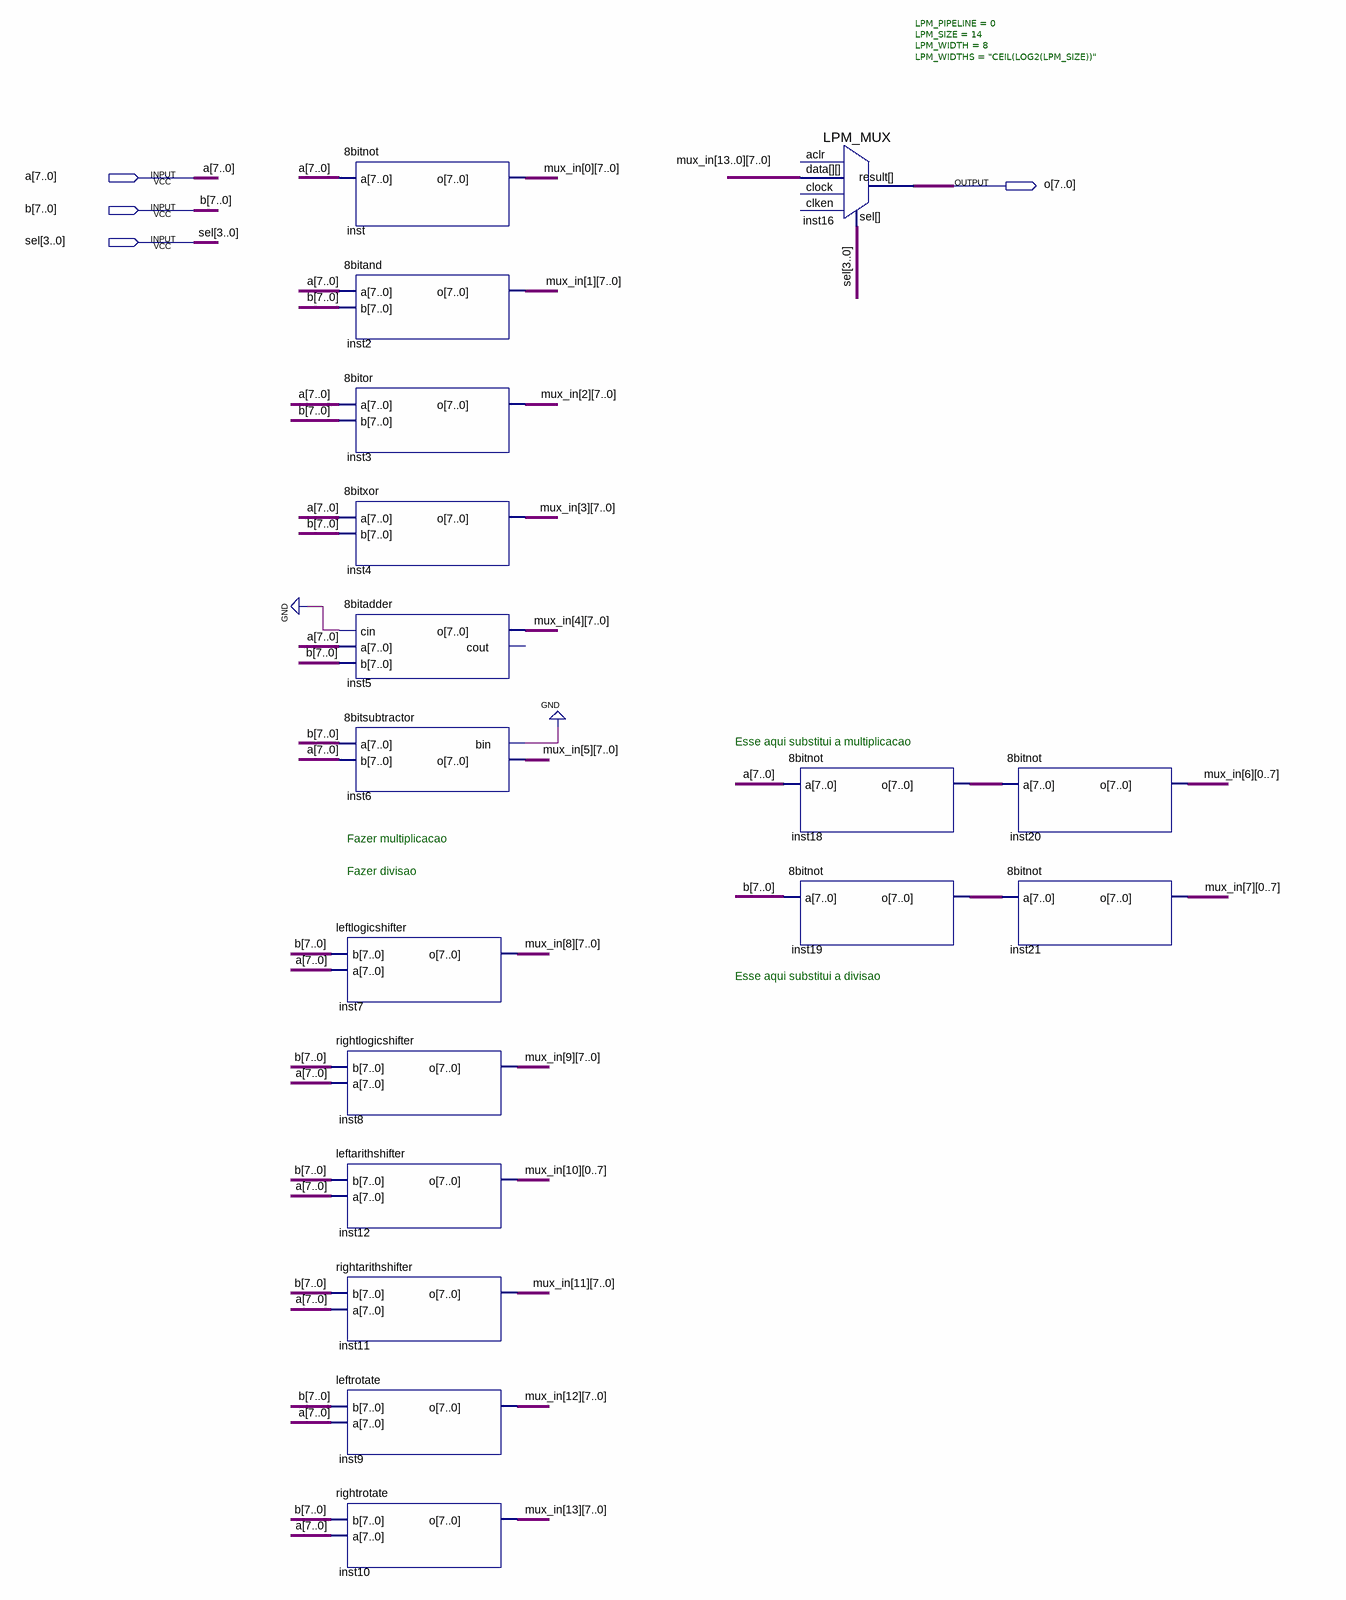
[diagram p0: schematic sheet]
// Quartus schematic ula.bdf as structural Verilog: 17 symbols, 4 pins
module ula (
  input  [7:0] a,
  input  [7:0] b,
  input  [3:0] sel,
  output [7:0] o
);

  wire inst6_bin;
  wire [7:0] inst18_o, inst19_o, mux_in_0, mux_in_1, mux_in_2, mux_in_3, mux_in_4, mux_in_5, mux_in_6,
       mux_in_7, mux_in_8, mux_in_9, mux_in_10, mux_in_11, mux_in_12, mux_in_13;

  \8bitnot  inst (.a(a), .o(mux_in_0));
  \8bitand  inst2 (.a(a), .b(b), .o(mux_in_1));
  \8bitor  inst3 (.a(a), .b(b), .o(mux_in_2));
  \8bitxor  inst4 (.a(a), .b(b), .o(mux_in_3));
  \8bitadder  inst5 (.cin(1'b0), .a(a), .b(b), .o(mux_in_4));  // open: cout
  \8bitsubtractor  inst6 (.a(b), .b(a), .bin(inst6_bin), .o(mux_in_5));
  leftlogicshifter inst7 (.b(b), .a(a), .o(mux_in_8));
  rightlogicshifter inst8 (.b(b), .a(a), .o(mux_in_9));
  leftarithshifter inst12 (
    .b(b), .a(a),
    .o({mux_in_10[0], mux_in_10[1], mux_in_10[2], mux_in_10[3], mux_in_10[4], mux_in_10[5], mux_in_10[6], mux_in_10[7]}));
  rightarithshifter inst11 (.b(b), .a(a), .o(mux_in_11));
  leftrotate inst9 (.b(b), .a(a), .o(mux_in_12));
  rightrotate inst10 (.b(b), .a(a), .o(mux_in_13));
  LPM_MUX #(.LPM_PIPELINE(0), .LPM_SIZE(14), .LPM_WIDTH(8), .LPM_WIDTHS("CEIL(LOG2(LPM_SIZE))")) inst16 (
    .data({mux_in_13, mux_in_12, mux_in_11, mux_in_10, mux_in_9, mux_in_8, mux_in_7, mux_in_6, mux_in_5, mux_in_4, mux_in_3, mux_in_2, mux_in_1, mux_in_0}),
    .sel(sel), .result(o));  // open: clock, aclr, clken
  \8bitnot  inst18 (.a(a), .o(inst18_o));
  \8bitnot  inst19 (.a(b), .o(inst19_o));
  \8bitnot  inst20 (
    .a(inst18_o),
    .o({mux_in_6[0], mux_in_6[1], mux_in_6[2], mux_in_6[3], mux_in_6[4], mux_in_6[5], mux_in_6[6], mux_in_6[7]}));
  \8bitnot  inst21 (
    .a(inst19_o),
    .o({mux_in_7[0], mux_in_7[1], mux_in_7[2], mux_in_7[3], mux_in_7[4], mux_in_7[5], mux_in_7[6], mux_in_7[7]}));
  // also tied to GND on the sheet: inst6_bin

  // Notes on the sheet:
  //   Esse aqui substitui a multiplicacao
  //   Fazer multiplicacao
  //   Fazer divisao
  //   Esse aqui substitui a divisao
endmodule
